# EAGLE board linuxstamp122 (EAGLE 5.03), part 1 of 2
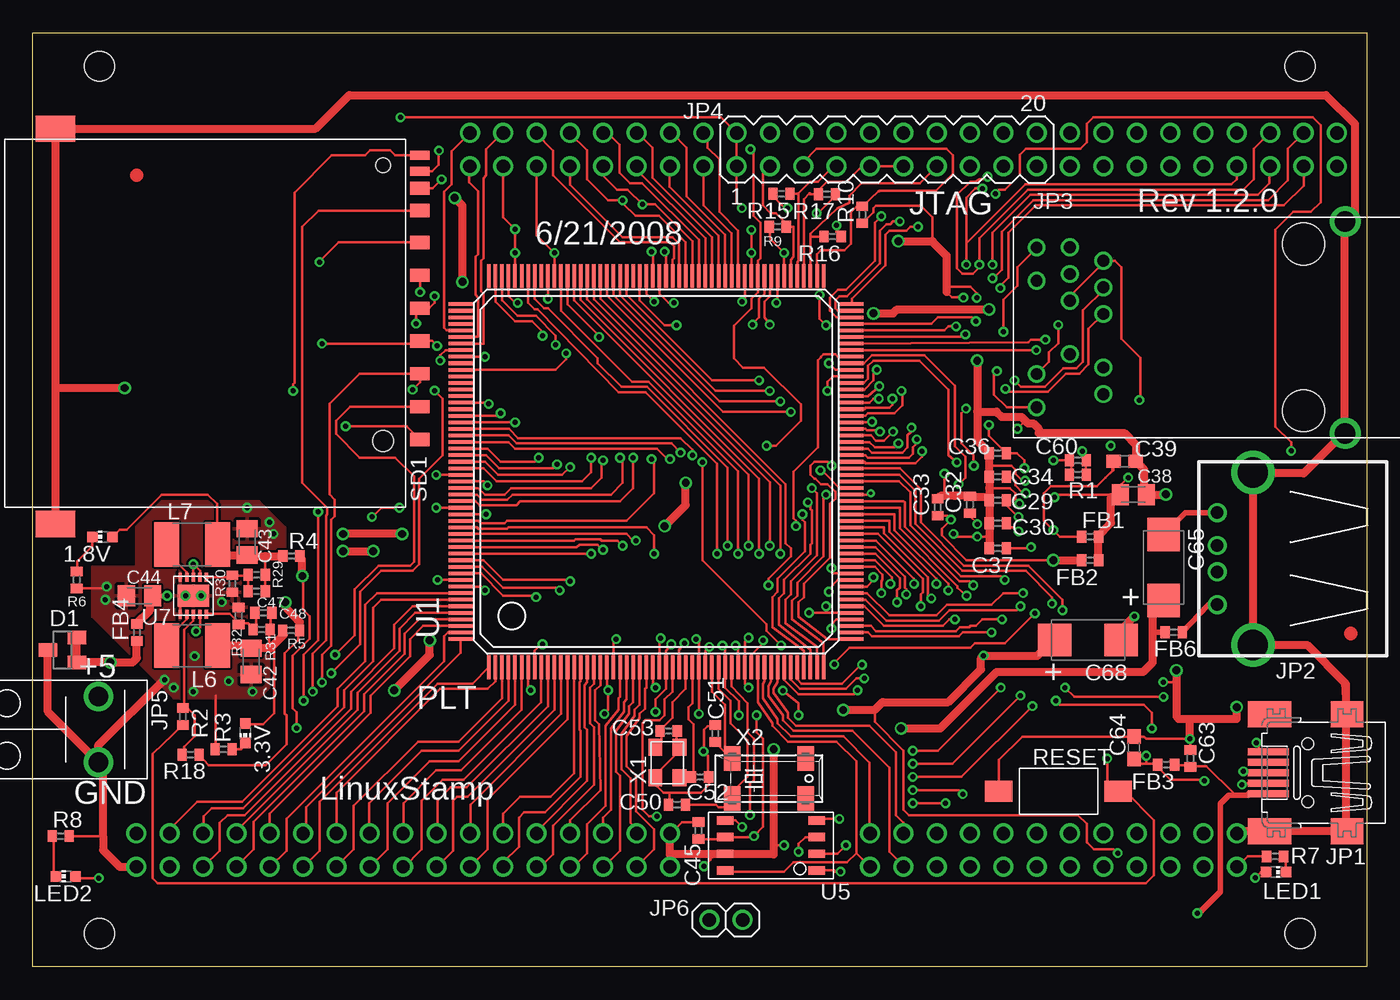
[diagram p2: board, top side]
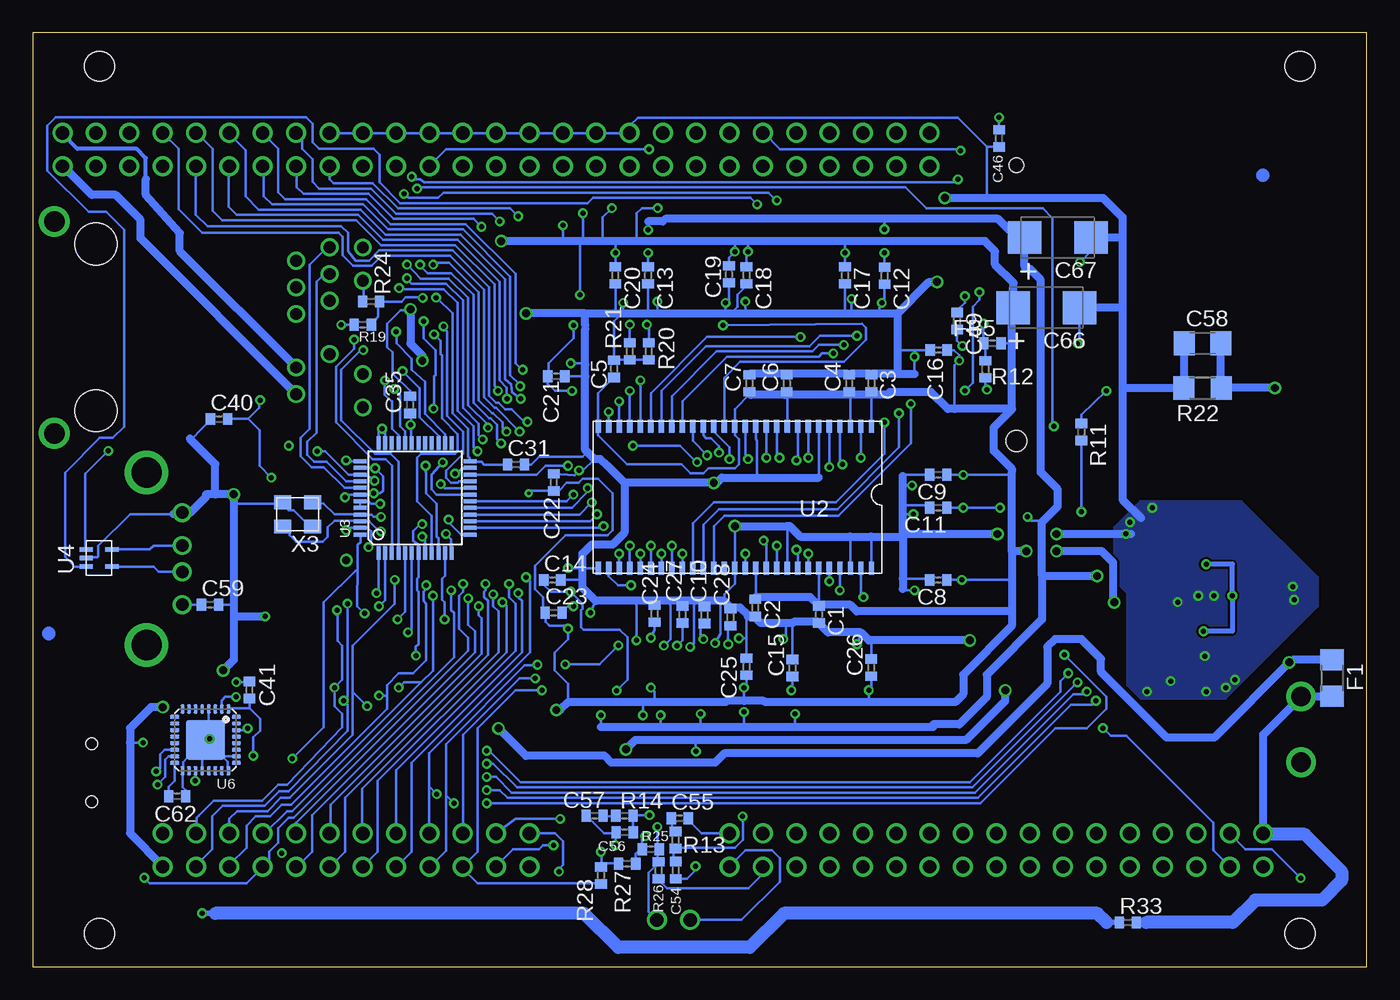
[diagram p3: board, bottom side, seen from below]

Size 101.6 x 71.12 mm. Coordinates in mm from the lower left corner, seen from the top.
Outline: 0,0 0,71.12 101.6,71.12 101.6,0 0,0
Copper layers (1*16): Top 0.035mm / dielectric 1.5mm / Bottom 0.035mm
Design rules "default *": minimum track width 0.1245mm, minimum drill 10mil, track to track 7mil, track to pad 7mil, pad to pad 7mil, via to via 7mil, smd to smd 0mil, copper to edge 8mil, drill to drill 8mil, minimum pad ring 7mil, minimum via ring 7mil, stop-mask expansion 2mil, vias tented up to drill 0mil, thermal gap 10mil
Holes 2.29 mm at 5.08,2.54 96.52,2.54 96.52,68.58 5.08,68.58

## Footprints (pad centres in the part's own frame; a part is rotated, then mirrored left to right if it is on the bottom)
CHIP-LED0603 = smd 0.8 x 0.8: A 0,-0.75; C 0,0.75
C0402 = smd 0.7 x 0.9: 1 -0.65,0; 2 0.65,0
C0805K = smd 1.3 x 1.6: 1 -1,0; 2 1,0
C0603 = smd 1.1 x 1: 1 -0.85,0; 2 0.85,0
0402 = smd 0.7 x 0.9: 1 -0.65,0; 2 0.65,0
C1206 = smd 1.6 x 1.8: 1 -1.4,0; 2 1.4,0
C/6032-28R = smd 2.55 x 2.5: + 2.525,0; - -2.525,0
SOT23 = smd 1 x 1.4: 1 -0.95,-1.1; 2 0.95,-1.1; 3 0,1.1
R1206 = smd 1.6 x 1.8: 1 -1.4,0; 2 1.4,0
1X01 = drill 1.016 round: 1 0,0
32005-201 = smd 3.1 x 0.5: 1 3,1.6; 2 3,0.8; 3 3,0; 4 3,-0.8; 5 3,-1.6 | smd 2.5 x 2: M1 -3,-4.45; M2 -3,4.45 | smd 3.3 x 2: M3 2.9,4.45; M4 2.9,-4.45 | hole 0.9: 0,2.2; 0,-2.2
PN87520 = drill 0.95 round: 1 -3.5,2.71; 2 -1,2.71; 3 1,2.71; 4 3.5,2.71 | drill 2.3 round: G1 -6.57,0; G2 6.57,0
CON-PULSE-POE-J415 = drill 0.9 round: P1 5.08,9.66; P2 3.048,9.66; P3 1.016,9.66; P5 -3.048,9.66; P6 -5.08,9.66; P7 6.096,12.2; P8 4.064,12.2; P9 2.032,12.2; P13 6.09,14.74; P14 3.55,14.74; P15 -3.55,14.74; P16 -6.09,14.74; S3 -2.032,12.2 | drill 1.57 round: S1 8.065,-8.76; S2 -8.065,-8.76 | hole 3.2: 6.35,-5.58; -6.35,-5.58
MA10-2 = drill 1.016 round: 1 -11.43,-1.27; 2 -11.43,1.27; 3 -8.89,-1.27; 4 -8.89,1.27; 5 -6.35,-1.27; 6 -6.35,1.27; 7 -3.81,-1.27; 8 -3.81,1.27; 9 -1.27,-1.27; 10 -1.27,1.27; 11 1.27,-1.27; 12 1.27,1.27; 13 3.81,-1.27; 14 3.81,1.27; 15 6.35,-1.27; 16 6.35,1.27; 17 8.89,-1.27; 18 8.89,1.27; 19 11.43,-1.27; 20 11.43,1.27
CON-PC-5.0-2 = drill 1.5 round: 1 -2.5,0; 2 2.5,0
1X02 = drill 1.016 round: 1 -1.27,0; 2 1.27,0
L1812 = smd 1.9 x 3.4: 1 -1.95,0; 2 1.95,0
R0402 = smd 0.7 x 0.9: 1 -0.65,0; 2 0.65,0
R1206' = smd 1.6 x 1.803: 1 -1.422,0; 2 1.422,0
SWITCH-6X3.5 = smd 2.1 x 1.6: 1 -4.55,0; 2 4.55,0
CON-3M-SD = smd 1 x 1.5: 1 6.35,16.35; 2 3.85,16.35; 3 1.35,16.35; 4 -1.15,16.35; 5 -3.64,16.35; 6 -6.15,16.35; 7 -8.58,16.35; 8 -10.28,16.35; 9 8.85,16.35 | smd 0.7 x 1.5: CD -11.58,16.35; WP -12.78,16.35 | smd 2 x 3: GP1 -14.81,-11.4; GP2 15.29,-11.4 | hole 1.6: 8.97,13.55 | hole 1.1: -12.03,13.55
LQFP208 = smd 1.8 x 0.27: 1 -14.9,12.75; 2 -14.9,12.25; 3 -14.9,11.75; 4 -14.9,11.25; 5 -14.9,10.75; 6 -14.9,10.25; 7 -14.9,9.75; 8 -14.9,9.25; 9 -14.9,8.75; 10 -14.9,8.25; 11 -14.9,7.75; 12 -14.9,7.25; 13 -14.9,6.75; 14 -14.9,6.25; 15 -14.9,5.75; 16 -14.9,5.25; 17 -14.9,4.75; 18 -14.9,4.25; 19 -14.9,3.75; 20 -14.9,3.25; 21 -14.9,2.75; 22 -14.9,2.25; 23 -14.9,1.75; 24 -14.9,1.25; 25 -14.9,0.75; 26 -14.9,0.25; 27 -14.9,-0.25; 28 -14.9,-0.75; 29 -14.9,-1.25; 30 -14.9,-1.75; 31 -14.9,-2.25; 32 -14.9,-2.75; 33 -14.9,-3.25; 34 -14.9,-3.75; 35 -14.9,-4.25; 36 -14.9,-4.75; 37 -14.9,-5.25; 38 -14.9,-5.75; 39 -14.9,-6.25; 40 -14.9,-6.75; 41 -14.9,-7.25; 42 -14.9,-7.75; 43 -14.9,-8.25; 44 -14.9,-8.75; 45 -14.9,-9.25; 46 -14.9,-9.75; 47 -14.9,-10.25; 48 -14.9,-10.75; 49 -14.9,-11.25; 50 -14.9,-11.75; 51 -14.9,-12.25; 52 -14.9,-12.75; 105 14.9,-12.75; 106 14.9,-12.25; 107 14.9,-11.75; 108 14.9,-11.25; 109 14.9,-10.75; 110 14.9,-10.25; 111 14.9,-9.75; 112 14.9,-9.25; 113 14.9,-8.75; 114 14.9,-8.25; 115 14.9,-7.75; 116 14.9,-7.25; 117 14.9,-6.75; 118 14.9,-6.25; 119 14.9,-5.75; 120 14.9,-5.25; 121 14.9,-4.75; 122 14.9,-4.25; 123 14.9,-3.75; 124 14.9,-3.25; 125 14.9,-2.75; 126 14.9,-2.25; 127 14.9,-1.75; 128 14.9,-1.25; 129 14.9,-0.75; 130 14.9,-0.25; 131 14.9,0.25; 132 14.9,0.75; 133 14.9,1.25; 134 14.9,1.75; 135 14.9,2.25; 136 14.9,2.75; 137 14.9,3.25; 138 14.9,3.75; 139 14.9,4.25; 140 14.9,4.75; 141 14.9,5.25; 142 14.9,5.75; 143 14.9,6.25; 144 14.9,6.75; 145 14.9,7.25; 146 14.9,7.75; 147 14.9,8.25; 148 14.9,8.75; 149 14.9,9.25; 150 14.9,9.75; 151 14.9,10.25; 152 14.9,10.75; 153 14.9,11.25; 154 14.9,11.75; 155 14.9,12.25; 156 14.9,12.75 | smd 0.27 x 1.8: 53 -12.75,-14.9; 54 -12.25,-14.9; 55 -11.75,-14.9; 56 -11.25,-14.9; 57 -10.75,-14.9; 58 -10.25,-14.9; 59 -9.75,-14.9; 60 -9.25,-14.9; 61 -8.75,-14.9; 62 -8.25,-14.9; 63 -7.75,-14.9; 64 -7.25,-14.9; 65 -6.75,-14.9; 66 -6.25,-14.9; 67 -5.75,-14.9; 68 -5.25,-14.9; 69 -4.75,-14.9; 70 -4.25,-14.9; 71 -3.75,-14.9; 72 -3.25,-14.9; 73 -2.75,-14.9; 74 -2.25,-14.9; 75 -1.75,-14.9; 76 -1.25,-14.9; 77 -0.75,-14.9; 78 -0.25,-14.9; 79 0.25,-14.9; 80 0.75,-14.9; 81 1.25,-14.9; 82 1.75,-14.9; 83 2.25,-14.9; 84 2.75,-14.9; 85 3.25,-14.9; 86 3.75,-14.9; 87 4.25,-14.9; 88 4.75,-14.9; 89 5.25,-14.9; 90 5.75,-14.9; 91 6.25,-14.9; 92 6.75,-14.9; 93 7.25,-14.9; 94 7.75,-14.9; 95 8.25,-14.9; 96 8.75,-14.9; 97 9.25,-14.9; 98 9.75,-14.9; 99 10.25,-14.9; 100 10.75,-14.9; 101 11.25,-14.9; 102 11.75,-14.9; 103 12.25,-14.9; 104 12.75,-14.9; 157 12.75,14.9; 158 12.25,14.9; 159 11.75,14.9; 160 11.25,14.9; 161 10.75,14.9; 162 10.25,14.9; 163 9.75,14.9; 164 9.25,14.9; 165 8.75,14.9; 166 8.25,14.9; 167 7.75,14.9; 168 7.25,14.9; 169 6.75,14.9; 170 6.25,14.9; 171 5.75,14.9; 172 5.25,14.9; 173 4.75,14.9; 174 4.25,14.9; 175 3.75,14.9; 176 3.25,14.9; 177 2.75,14.9; 178 2.25,14.9; 179 1.75,14.9; 180 1.25,14.9; 181 0.75,14.9; 182 0.25,14.9; 183 -0.25,14.9; 184 -0.75,14.9; 185 -1.25,14.9; 186 -1.75,14.9; 187 -2.25,14.9; 188 -2.75,14.9; 189 -3.25,14.9; 190 -3.75,14.9; 191 -4.25,14.9; 192 -4.75,14.9; 193 -5.25,14.9; 194 -5.75,14.9; 195 -6.25,14.9; 196 -6.75,14.9; 197 -7.25,14.9; 198 -7.75,14.9; 199 -8.25,14.9; 200 -8.75,14.9; 201 -9.25,14.9; 202 -9.75,14.9; 203 -10.25,14.9; 204 -10.75,14.9; 205 -11.25,14.9; 206 -11.75,14.9; 207 -12.25,14.9; 208 -12.75,14.9
TSOPII-54 = smd 0.4 x 1: 1 0,0; 2 0.8,0; 3 1.6,0; 4 2.4,0; 5 3.2,0; 6 4,0; 7 4.8,0; 8 5.6,0; 9 6.4,0; 10 7.2,0; 11 8,0; 12 8.8,0; 13 9.6,0; 14 10.4,0; 15 11.2,0; 16 12,0; 17 12.8,0; 18 13.6,0; 19 14.4,0; 20 15.2,0; 21 16,0; 22 16.8,0; 23 17.6,0; 24 18.4,0; 25 19.2,0; 26 20,0; 27 20.8,0; 28 20.8,10.8; 29 20,10.8; 30 19.2,10.8; 31 18.4,10.8; 32 17.6,10.8; 33 16.8,10.8; 34 16,10.8; 35 15.2,10.8; 36 14.4,10.8; 37 13.6,10.8; 38 12.8,10.8; 39 12,10.8; 40 11.2,10.8; 41 10.4,10.8; 42 9.6,10.8; 43 8.8,10.8; 44 8,10.8; 45 7.2,10.8; 46 6.4,10.8; 47 5.6,10.8; 48 4.8,10.8; 49 4,10.8; 50 3.2,10.8; 51 2.4,10.8; 52 1.6,10.8; 53 0.8,10.8; 54 0,10.8
TQFP48 = smd 1.016 x 0.305: 1 -4.191,2.794; 2 -4.191,2.286; 3 -4.191,1.778; 4 -4.191,1.27; 5 -4.191,0.762; 6 -4.191,0.254; 7 -4.191,-0.254; 8 -4.191,-0.762; 9 -4.191,-1.27; 10 -4.191,-1.778; 11 -4.191,-2.286; 12 -4.191,-2.794; 25 4.191,-2.794; 26 4.191,-2.286; 27 4.191,-1.778; 28 4.191,-1.27; 29 4.191,-0.762; 30 4.191,-0.254; 31 4.191,0.254; 32 4.191,0.762; 33 4.191,1.27; 34 4.191,1.778; 35 4.191,2.286; 36 4.191,2.794 | smd 0.305 x 1.016: 13 -2.794,-4.191; 14 -2.286,-4.191; 15 -1.778,-4.191; 16 -1.27,-4.191; 17 -0.762,-4.191; 18 -0.254,-4.191; 19 0.254,-4.191; 20 0.762,-4.191; 21 1.27,-4.191; 22 1.778,-4.191; 23 2.286,-4.191; 24 2.794,-4.191; 37 2.794,4.191; 38 2.286,4.191; 39 1.778,4.191; 40 1.27,4.191; 41 0.762,4.191; 42 0.254,4.191; 43 -0.254,4.191; 44 -0.762,4.191; 45 -1.27,4.191; 46 -1.778,4.191; 47 -2.286,4.191; 48 -2.794,4.191
SOT323-5 = smd 0.35 x 1: 1 0.65,0.975; 2 0,0.975; 3 -0.65,0.975; 4 -0.65,-0.975; 5 0.65,-0.975
CASON-8 = smd 1.27 x 0.635: 1 -3.5,1.905; 2 -3.5,0.635; 3 -3.5,-0.635; 4 -3.5,-1.905; 5 3.485,-1.905; 6 3.485,-0.635; 7 3.485,0.635; 8 3.485,1.905
MLF32_2 = smd 0.7 x 0.3: 1 -2.35,1.75; 2 -2.35,1.25; 3 -2.35,0.75; 4 -2.35,0.25; 5 -2.35,-0.25; 6 -2.35,-0.75; 7 -2.35,-1.25; 8 -2.35,-1.75; 17 2.35,-1.75; 18 2.35,-1.25; 19 2.35,-0.75; 20 2.35,-0.25; 21 2.35,0.25; 22 2.35,0.75; 23 2.35,1.25; 24 2.35,1.75 | smd 0.3 x 0.7: 9 -1.75,-2.35; 10 -1.25,-2.35; 11 -0.75,-2.35; 12 -0.25,-2.35; 13 0.25,-2.35; 14 0.75,-2.35; 15 1.25,-2.35; 16 1.75,-2.35; 25 1.75,2.35; 26 1.25,2.35; 27 0.75,2.35; 28 0.25,2.35; 29 -0.25,2.35; 30 -0.75,2.35; 31 -1.25,2.35; 32 -1.75,2.35 | smd 3 x 3: 33 0,0
DFN-10 = smd 0.25 x 0.675: 1 -1,-1.413; 2 -0.5,-1.413; 3 0,-1.413; 4 0.5,-1.413; 5 1,-1.413; 6 1,1.413; 7 0.5,1.413; 8 0,1.413; 9 -0.5,1.413; 10 -1,1.413 | smd 2.38 x 1.65: 11 0,0
CRYSTAL-3.2-2.5 = smd 1.3 x 1.05: 1 -1.15,-0.925; 2 1.15,-0.925; 3 1.15,0.925; 4 -1.15,0.925
MM20SS = smd 1.27 x 1.88: 1 -2.794,-1.524; 2 2.794,-1.524; 3 2.794,1.524; 4 -2.794,1.524

## Placement (x,y rotation side)
1.8V  [CHIP-LED0603]  5.3,32.74 90 top
3.3V  [CHIP-LED0603]  16.19,17.78 180 top
C1  100n  [C0402]  41.72,26.83 270 bottom
C2  100n  [C0402]  46.57,27.33 270 bottom
C3  100n  [C0402]  37.72,44.43 90 bottom
C4  100n  [C0402]  39.42,44.43 90 bottom
C5  100n  [C0402]  57.32,45.53 90 bottom
C6  100n  [C0402]  44.17,44.43 90 bottom
C7  100n  [C0402]  47.02,44.43 90 bottom
C8  100n  [C0402]  32.63,29.46 180 bottom
C9  100n  [C0402]  32.63,37.46 180 bottom
C10  100n  [C0402]  50.44,26.79 90 bottom
C11  100n  [C0402]  32.63,34.96 180 bottom
C12  100n  [C0402]  36.72,52.63 270 bottom
C13  100n  [C0402]  54.73,52.66 270 bottom
C14  100n  [C0402]  62.03,29.46 0 bottom
C15  100n  [C0402]  43.73,22.76 90 bottom
C16  100n  [C0402]  32.6,46.97 180 bottom
C17  100n  [C0402]  39.73,52.66 270 bottom
C18  100n  [C0402]  47.23,52.66 270 bottom
C19  100n  [C0402]  48.57,52.73 270 bottom
C20  100n  [C0402]  57.23,52.66 270 bottom
C21  100n  [C0402]  61.73,44.96 0 bottom
C22  100n  [C0402]  61.92,36.89 90 bottom
C23  100n  [C0402]  61.93,26.96 0 bottom
C24  100n  [C0402]  54.24,26.89 90 bottom
C25  100n  [C0402]  47.23,22.86 90 bottom
C26  100n  [C0402]  37.74,22.79 90 bottom
C27  100n  [C0402]  52.12,26.83 90 bottom
C28  100n  [C0402]  48.47,26.63 90 bottom
C29  18pF  [C0402]  73.5,35.53 180 top
C30  18pF  [C0402]  73.5,33.78 180 top
C31  100n  [C0402]  64.8,38.25 0 bottom
C32  100n  [C0402]  71.37,35.19 90 top
C33  100n  [C0402]  68.92,34.99 90 top
C34  100n  [C0402]  73.5,37.32 180 top
C35  100n  [C0402]  72.87,42.79 90 bottom
C36  100n  [C0402]  73.5,39.12 180 top
C37  100n  [C0402]  73.5,31.87 180 top
C38  10uF  [C0805K]  83.83,35.96 0 top
C39  4.7uF  [C0603]  83.16,38.5 0 top
C40  100n  [C0402]  87.42,41.71 0 bottom
C41  100n  [0402]  85.1,21.08 90 bottom
C42  10uF  [C0805K]  16.63,23.26 270 top
C43  10uF  [C0805K]  16.33,32.36 270 top
C44  10uF  [C0805K]  8.13,28.26 0 top
C45  100n  [C0402]  50.7,10.38 90 top
C46  100n  [C0402]  28,63.08 90 bottom
C47  22pF  [0402]  17.06,28.6 180 top
C48  22pF  [0402]  17.56,26.96 180 top
C49  100nF  [C0402]  31.2,49.18 270 bottom
C50  12.5p  [C0402]  49.07,12.35 180 top
C51  12.5p  [C0402]  51.98,17.77 90 top
C52  18p  [C0402]  50.83,14.46 0 top
C53  18p  [C0402]  48.43,17.96 0 top
C54  680p  [C0402]  52.63,7.37 270 bottom
C55  5.6n  [C0402]  52.32,11.31 0 bottom
C56  470p  [C0402]  56.52,10.26 180 bottom
C57  4.7n  [C0402]  58.82,11.51 180 bottom
C58  1000pF  [C1206]  12.5,47.48 0 bottom
C59  100n  [C0402]  88.1,27.58 0 bottom
C60  100pF  [C0402]  79.6,37.48 0 top
C62  100n  [0402]  90.61,13 0 bottom
C63  10n  [0402]  88.17,15.87 90 top
C64  4.7uF  [C0603]  83.88,16.69 90 top
C65  100uF  [C/6032-28R]  86.13,30.41 270 top
C66  100uF  [C/6032-28R]  24.4,50.18 180 bottom
C67  100uF  [C/6032-28R]  23.53,55.53 180 bottom
C68  100uF  [C/6032-28R]  80.37,24.89 180 top
D1  [SOT23]  2.25,24.13 90 top
F1  [R1206]  2.63,22 90 bottom
FB1  [0402]  80.53,32.76 0 top
FB2  [0402]  80.53,30.96 180 top
FB3  [0402]  86.32,15.4 180 top
FB4  L0402  [0402]  7.93,25.46 90 top
FB5  [0402]  28.5,47.48 0 bottom
FB6  [0402]  86.9,25.48 0 top
J2  [1X01]  63.77,7.62 0 top
J3  [1X01]  63.77,10.16 0 top
J4  [1X01]  66.31,7.62 0 top
J5  [1X01]  66.31,10.16 0 top
J6  [1X01]  68.85,7.62 0 top
J7  [1X01]  68.85,10.16 0 top
J8  [1X01]  71.39,7.62 0 top
J9  [1X01]  71.39,10.16 0 top
J10  [1X01]  73.93,7.62 0 top
J11  [1X01]  73.93,10.16 0 top
J12  [1X01]  76.47,7.62 0 top
J13  [1X01]  76.47,10.16 0 top
J14  [1X01]  79.01,7.62 0 top
J15  [1X01]  79.01,10.16 0 top
J16  [1X01]  81.55,7.62 0 top
J17  [1X01]  81.55,10.16 0 top
J18  [1X01]  84.09,7.62 0 top
J19  [1X01]  84.09,10.16 0 top
J20  [1X01]  86.63,7.62 0 top
J21  [1X01]  86.63,10.16 0 top
J22  [1X01]  89.17,7.62 0 top
J23  [1X01]  89.17,10.16 0 top
J24  [1X01]  38.37,7.62 0 top
J25  [1X01]  40.91,10.16 0 top
J26  [1X01]  40.91,7.62 0 top
J27  [1X01]  43.45,10.16 0 top
J28  [1X01]  43.45,7.62 0 top
J29  [1X01]  45.99,10.16 0 top
J30  [1X01]  45.99,7.62 0 top
J31  [1X01]  33.29,63.5 0 top
J32  [1X01]  33.29,60.96 0 top
J33  [1X01]  35.83,63.5 0 top
J34  [1X01]  30.75,7.62 0 top
J35  [1X01]  33.29,10.16 0 top
J36  [1X01]  33.29,7.62 0 top
J37  [1X01]  35.83,10.16 0 top
J38  [1X01]  35.83,7.62 0 top
J39  [1X01]  38.37,10.16 0 top
J40  [1X01]  10.43,10.16 0 top
J41  [1X01]  12.97,10.16 0 top
J42  [1X01]  12.97,7.62 0 top
J43  [1X01]  15.51,10.16 0 top
J44  [1X01]  15.51,7.62 0 top
J45  [1X01]  18.05,10.16 0 top
J46  [1X01]  18.05,7.62 0 top
J47  [1X01]  20.59,10.16 0 top
J48  [1X01]  20.59,7.62 0 top
J49  [1X01]  23.13,10.16 0 top
J50  [1X01]  23.13,7.62 0 top
J51  [1X01]  25.67,10.16 0 top
J52  [1X01]  25.67,7.62 0 top
J53  [1X01]  28.21,10.16 0 top
J54  [1X01]  28.21,7.62 0 top
J55  [1X01]  30.75,10.16 0 top
J56  [1X01]  96.79,60.96 0 top
J57  [1X01]  96.79,63.5 0 top
J58  [1X01]  94.25,60.96 0 top
J59  [1X01]  94.25,63.5 0 top
J60  [1X01]  91.71,60.96 0 top
J61  [1X01]  91.71,63.5 0 top
J62  [1X01]  89.17,60.96 0 top
J63  [1X01]  89.17,63.5 0 top
J64  [1X01]  86.63,60.96 0 top
J65  [1X01]  86.63,63.5 0 top
J66  [1X01]  84.09,60.96 0 top
J67  [1X01]  84.09,63.5 0 top
J68  [1X01]  79.01,60.96 0 top
J69  [1X01]  81.55,63.5 0 top
J70  [1X01]  81.55,60.96 0 top
J71  [1X01]  51.07,63.5 0 top
J72  [1X01]  51.07,60.96 0 top
J73  [1X01]  48.53,63.5 0 top
J74  [1X01]  48.53,60.96 0 top
J75  [1X01]  45.99,63.5 0 top
J76  [1X01]  45.99,60.96 0 top
J77  [1X01]  43.45,63.5 0 top
J78  [1X01]  38.37,63.5 0 top
J79  [1X01]  40.91,60.96 0 top
J80  [1X01]  7.89,10.16 0 top
J81  [1X01]  7.89,7.62 0 top
J82  j85  [1X01]  43.45,60.96 0 top
J83  j85  [1X01]  40.91,63.5 0 top
J84  j85  [1X01]  38.37,60.96 0 top
J85  j85  [1X01]  35.83,60.96 0 top
J86  [1X01]  79.01,63.5 0 top
J87  j85  [1X01]  48.53,10.16 0 top
J88  j85  [1X01]  48.53,7.62 0 top
J89  j85  [1X01]  91.71,10.16 0 top
J90  j85  [1X01]  91.71,7.62 0 top
J91  j85  [1X01]  99.33,60.96 0 top
J92  j85  [1X01]  99.33,63.5 0 top
J93  j85  [1X01]  10.43,7.62 0 top
JP1  [32005-201]  97.1,14.78 180 top
JP2  [PN87520]  92.93,31.08 90 top
JP3  CON-PULSE-POE-J14  [CON-PULSE-POE-J415]  91.2,48.69 90 top
JP4  JTAG  [MA10-2]  65.04,62.23 0 top
JP5  [CON-PC-5.0-2]  5,18.08 270 top
JP6  [1X02]  52.8,3.57 180 top
L6  2.2uH  [L1812]  12.13,24.46 180 top
L7  2.2uH  [L1812]  12.13,32.16 0 top
LED1  [CHIP-LED0603]  94.7,7.22 270 top
LED2  [CHIP-LED0603]  2.5,6.89 90 top
R1  6.49k  [R0402]  79.6,38.57 180 top
R2  10k  [0402]  11.43,19.06 270 top
R3  200  [0402]  14.53,16.56 0 top
R4  0  [0402]  19.7,31.28 180 top
R5  0  [0402]  19.68,25.62 0 top
R6  200  [0402]  3.34,29.46 270 top
R7  200  [0402]  94.62,8.41 0 top
R8  200  [0402]  2.13,9.96 0 top
R9  100k  [R0402]  56.74,56.36 0 top
R10  100k  [R0402]  63.18,57.27 90 top
R11  0  [R0402]  21.74,40.73 270 bottom
R12  10k  [R0402]  29.03,45.5 90 bottom
R13  1.27k  [R0402]  52.64,9.66 270 bottom
R14  1.96k  [R0402]  56.54,11.51 0 bottom
R15  100k  [R0402]  57.02,58.86 180 top
R16  100k  [R0402]  60.92,55.61 180 top
R17  100k  [R0402]  60.49,58.83 180 top
R18  100k  [0402]  12.03,16.16 0 top
R19  200  [R0402]  76.47,48.9 180 bottom
R20  1k  [R0402]  54.68,46.87 90 bottom
R21  1k  [R0402]  56.13,46.87 90 bottom
R22  1M  [R1206']  12.5,44.08 180 bottom
R24  200  [R0402]  75.83,50.66 180 bottom
R25  [R0402]  54.53,8.96 0 bottom
R26  [R0402]  53.93,7.36 270 bottom
R27  [R0402]  56.33,7.86 180 bottom
R28  [R0402]  58.33,6.96 270 bottom
R29  887k  [0402]  17.06,29.84 180 top
R30  442k  [0402]  15.2,29.18 270 top
R31  887k  [0402]  17.44,25.69 0 top
R32  197k  [0402]  15.69,26.72 90 top
R33  0  [0402]  18.2,3.38 0 bottom
RESET  SWITCH-PUSHBUTTON-6X3.5  [SWITCH-6X3.5]  78.13,13.36 0 top
SD1  CON-EM-SD  [CON-3M-SD]  13.13,49.01 270 top
U1  AT91RM9200_PQFP  [LQFP208]  47.48,37.71 90 top
U2  MT48LC8M16A2  [TSOPII-54]  37.73,41.16 180 bottom
U3  MICREL-KS8721  [TQFP48]  72.48,35.71 90 bottom
U4  USBDF01W5  [SOT323-5]  96.55,31.13 90 bottom
U5  DATAFLASH-8  [CASON-8]  56.22,9.25 180 top
U6  FT232RQ2  [MLF32_2]  88.45,17.28 270 bottom
U7  PS-LTC3407-3  [DFN-10]  12.23,28.26 180 top
U$1  [FIDUCIAL_G10]  7.9,60.28 0 top
U$2  [FIDUCIAL_G10]  100.4,25.38 0 top
U$3  [FIDUCIAL_G10]  7.9,60.28 0 bottom
U$4  [FIDUCIAL_G10]  100.4,25.38 0 bottom
X1  18.432  [CRYSTAL-3.2-2.5]  48.33,15.56 90 top
X2  32.768khz  [MM20SS]  56.07,14.34 0 top
X3  25.0  [CRYSTAL-3.2-2.5]  81.43,34.46 180 bottom

## Tracks (layer width: path | path; a pad name or v marks a point on that pad's centre or on a via)
1V8
  Top 0.178: 14.71,31.53 14.83,31.66 14.83,31.27 | 14.13,32.16 14.23,32.06 | 14.13,32.16 L7.2 | 14.13,32.16 14.03,32.26 14.03,35.26 13.33,35.96 9.83,35.96 7.15,33.28 6.6,33.28 1.8V.A | R29.1 C47.1 | R29.1 17.71,29.87 17.7,29.88 | R29.1 17.71,31.27 17.7,31.28
  Top 0.6: L7.2 14.71,31.53 14.88,31.36 C43.2 16.43,31.26 16.45,31.28 17.7,31.28 19.14,31.28 R4.2
3V3
  Top 0.178: 14.08,24.41 14.13,24.36 | L6.1 14.08,24.41 | 14.08,24.41 13.23,25.26 | 3.3V.A 16.2,18.48 17.55,18.48 18.4,19.33 18.4,24.48 18.35,24.53 | 18.15,24.33 18,24.48 18,25.68 R31.2 18.1,25.8 18.1,26.97 | 18.1,26.97 18.1,26.98 | 18.1,26.97 C48.1
  Top 0.6: L6.1 16.33,24.46 16.63,24.16 C42.1 18.08,24.26 18.15,24.33 18.35,24.53 19.13,25.31 R5.1
5V  (via drill 0.38 pad 0.74)
  Top 0.178: U7.3 12.23,29.76 | U7.9 12.73,25.86 v12.43,25.56 | U7.3 | U7.3 v12.23,30.66 12.73,30.16 U7.2
  Top 0.381: C44.2 v10.23,28.26
  Top 0.6: FB4.2 7.93,26.16 8.93,27.16 8.93,28.06 C44.2
  Bottom 0.381: v12.23,30.66 10.23,30.66 v10.23,28.26 10.23,25.56 v12.43,25.56
+1V8  (via drill 0.38 pad 0.74, 0.6 pad 0.9)
  Top 0.178: 36.73,52.56 36.74,52.57 | v43.83,21.06 43.73,21.16 U1.19 43.73,21.06 v43.83,21.06 | 36.73,52.56 U1.152 | 54.73,52.56 U1.116 v54.73,54.36 v54.73,56.11 | 36.73,52.56 v36.73,54.36 v36.73,56.16 35.83,57.06 J85.1 | v43.53,19.26 43.83,19.56 v43.83,21.06 | v50.73,19.26 50.73,22.76 | v52.53,24.46 52.73,24.26 U1.37 52.73,21.26 53.78,20.21 v53.78,19.16 | 50.73,22.76 U1.33 | 50.73,22.76 50.73,24.76 v50.53,24.96 | 48.23,22.96 48.23,24.06 v48.63,24.56 | 30.83,34.96 v30.73,34.96 U1.188 | U1.62 61.33,29.46 60.63,28.76 v60.63,28.56 | v58.33,19.16 58.33,20.06 v57.13,21.04 | v47.43,19.41 47.43,20.36 48.23,21.16 48.23,22.96 | 48.23,22.96 U1.28 | v25.83,34.26 25.88,34.26 26.58,34.96 v27.93,34.96 | v20.1,18.18 20.1,19.38 19.8,19.68 19.8,23.68 21.1,24.98 21.1,26.68 20.6,27.18 20.6,29.78
  Top 0.6: 20.6,29.78 20.58,29.76 v20.53,29.76 20.51,29.78 20.5,29.78 20.5,31.03 R4.1
  Bottom 0.178: C10.1 50.73,25.85 50.73,25.16 v50.53,24.96 | 54.73,56.76 v54.73,56.11 | 36.73,56.96 v36.73,56.16 | C12.1 36.72,54.45 v36.73,54.36 | v54.73,54.36 C13.1 | v43.83,21.06 43.73,21.06 C15.1 | 43.73,18.16 43.53,18.26 v43.53,19.26 | C27.1 52.12,24.87 v52.53,24.46 | 50.73,18.26 v50.73,19.26 | 47.43,18.26 v47.43,19.41 | C11.1 v30.73,34.96 v27.93,34.96 | 53.63,18.06 53.78,18.26 v53.78,19.16 | C14.1 62.68,29.11 62.13,28.56 v60.63,28.56 59.73,27.66 59.73,27.26 59.83,27.16 59.83,25.86 59.65,25.68 56.9,25.68 56.3,25.08 56.3,21.87 v57.13,21.04 | 58.33,18.26 v58.33,19.16 | C28.1 48.63,25.82 v48.63,24.56 | 24.58,34.01 24.53,33.96 25.58,33.96 25.88,34.26 | J93.1 11.7,8.89 11.7,10.98 18.3,17.58 19.5,17.58 v20.1,18.18 | 25.88,34.26 25.9,34.28 | 25.88,34.26 v25.83,34.26
  Bottom 0.6: 58.33,18.26 53.78,18.26 50.73,18.26 47.43,18.26 43.53,18.26 33.03,18.26 33.03,18.46 31.03,18.46 28.93,20.56 28.93,22.26 24.73,26.46 24.73,29.78 | 24.73,29.78 24.73,33.86 24.58,34.01 23.53,35.06 23.53,36.36 24.83,37.66 24.83,52.31 25.7,53.18 26,53.18 26,53.28 26.05,53.34 C67.+ 26.05,55.23 26.2,55.08 28.08,56.96 36.73,56.96 53.42,56.96 53.62,56.76 54.73,56.76 | 24.73,29.78 24.7,29.78 24.68,29.76 v20.53,29.76
+2V5A  (via drill 0.38 pad 0.74, 0.6)
  Top 0.178: v77.73,30.96 71.13,30.96 69.23,32.86 69.23,33.36 v69.93,34.06 69.65,34.34 C33.1
  Top 0.6: v77.73,30.96 FB2.2
  Bottom 0.178: U3.13 68.99,32.92 69.93,33.86 v69.93,34.06
+2V5B  (via drill 0.38 pad 0.74)
  Top 0.178: v75.53,37.96 75.53,38.56 74.97,39.12 C36.1 72.83,40.44 v72.83,41.26 | C34.1 74.47,37.32 74.83,36.96 74.83,36.66 75.43,36.06 v75.63,36.06 | v77.83,35.76 78.03,35.96 82.53,35.96 | 82.03,35.76 82.13,35.76 82.43,35.76 82.63,35.96 | C38.1 82.93,36.06 82.93,36.76 v83.43,37.26 | JP3.P9 79,51.08 81.54,53.62 JP3.P1 82.41,53.77 82.9,53.28 82.9,47.83 84.35,46.38 84.35,43.13 arc-90 84.3,43.08 arc-90 84.28,43.1 v84.28,43.16
  Top 0.6: 82.53,35.96 82.63,35.96 C38.1 83,35.96 | FB2.1 81.13,31.01 81.13,32.76 FB1.2 82.13,33.81 82.13,35.76
  Bottom 0.178: 72.82,40.95 v72.83,41.26 72.81,41.28 72.8,41.28 | 72.73,39.86 | 72.73,39.86 U3.31 | v75.63,36.06 75.73,35.96 U3.42 77.63,35.96 v77.83,35.76 | 76.71,37.96 U3.38 75.87,38 v75.53,37.96 74.93,37.36 74.93,36.26 75.13,36.06 v75.63,36.06 | v75.63,36.06 75.73,36.16 75.63,36.16 | v83.43,37.26 84.33,38.16 84.33,40.86 85.2,41.73 | 72.73,39.86 72.8,39.93 72.8,41.28 | C35.1 72.8,42.17 72.8,41.28 | 86.89,41.73 86.9,41.73 | 86.89,41.73 C40.2 | 85.2,41.73 86.89,41.73 | 85.2,41.73 84.35,42.58 84.35,43.13 arc90 84.3,43.18 arc90 v84.28,43.16
+2V5C  (via drill 0.38 pad 0.74)
  Top 0.178: C37.1 75.82,31.87 v76.03,31.96 | FB1.1 78.23,32.76 v77.73,33.26 77.03,33.96 77.03,36.06 77.55,36.58 81.05,36.58 81.71,37.24 | 81.71,37.24 82.23,37.76 82.23,38.36 82.27,38.4 C39.1 | 81.71,37.24 82.3,37.83 82.3,38.58
  Top 0.6: C39.1 82.31,38.38 82.33,38.36 82.23,38.26
  Bottom 0.178: v77.73,33.26 77.57,33.42 U3.47 76.09,33.42 75.83,33.16 75.83,31.86 v76.03,31.96
+3V3  (via drill 0.25 pad 0.51, 0.38 pad 0.74, 0.6, 0.6 pad 0.9)
  Top 0.178: v54.53,21.26 54.23,21.56 54.23,22.86 | v31.03,46.16 31.03,46.56 31.43,46.96 U1.164 32.63,46.96 | v60.83,25.76 60.83,26.06 61.23,26.46 U1.56 | v59.93,51.16 59.93,49.36 v60.43,48.86 | v72.42,23.71 v72.43,23.71 | v55.13,19.16 55.13,17.86 55.63,17.36 55.63,10.66 v54.93,9.96 54.83,9.86 52.73,9.86 U5.6 | 64.13,19.56 64.13,18.66 66.33,16.46 66.33,11.96 66.73,11.56 79.62,11.56 80.3,10.88 80.3,9.48 80.32,9.46 80.33,9.46 80.83,8.96 82.32,8.96 v82.62,8.66 v82.63,8.66 | v71.93,33.71 71.93,33.76 71.37,34.32 C32.1 | 54.23,22.86 54.23,24.76 v54.53,25.06 | 47.23,52.56 U1.131 47.23,54.36 v47.13,54.46 | 57.23,52.56 U1.111 v57.23,54.36 56.19,55.4 R9.1 | 62.23,35.96 U1.75 63.73,35.96 v63.83,36.06 | v60.53,43.86 60.53,44.56 60.93,44.96 C21.1 | 54.23,22.86 U1.40 | v47.43,21.26 47.23,21.46 47.23,21.86 | 47.23,21.86 47.23,21.96 | U1.7 37.73,21.26 v37.93,21.06 | 47.23,21.86 U1.26 | 30.63,37.46 v30.73,37.46 U1.183 | v30.83,29.46 U1.199 | U1.146 v39.73,54.36 v39.72,54.36 38.37,55.71 J84.1 | U1.129 48.23,54.36 v48.13,54.46 | R10.1 63.29,56.72 64.03,57.46 64.03,57.76 64.23,57.96 67.63,57.96 68.53,57.06 68.53,55.26 68.53,55.16 | R16.1 61.23,55.85 v61.23,56.46 | R18.2 13.38,15.36 17.73,15.36 19.33,16.96 19.33,19.15 19.2,19.28 19.2,23.88 20.2,24.88 20.2,25.29 R5.2 | R17.1 61,58.79 61,58.58 59.8,57.38 v59.7,57.38 | U5.6 52.8,9.88 52.75,9.83 | 68.5,55.26 68.5,55.28 | v70.88,50.96 70.9,50.98 70,50.98 69.6,51.38 | v71.9,50.93 71.9,51.28 71.4,51.78 69.6,51.78 | v28,64.68 52.4,64.68 53.6,63.48 JP4.2 53.61,63.57 | 53.61,63.57 JP4.1 53.61,58.17 v54,57.78 | 53.61,63.57 53.6,63.58 | v57.5,57.78 57.3,57.78 56.47,58.61 R15.2
  Top 0.178: U5.6 52.7,9.88 52.55,9.73 C45.1
  Top 0.406: 72.45,23.68 v72.42,23.71 72.4,23.68
  Top 0.6: v61.73,19.56 64.13,19.56 64.73,20.16 69.73,20.16 72.23,22.66 72.23,23.51 v72.42,23.7 v72.42,23.71 | v65.93,55.26 68.5,55.26 | 68.5,55.26 68.53,55.26 | v23.63,31.66 v25.93,31.66 | 19.2,27.68 19.23,27.71 v19.23,27.76 19.21,27.78 19.2,27.78 19.2,27.48 20.33,26.25 R5.2 | 68.5,55.26 69.6,54.16 69.6,51.78 69.6,51.38 | C68.+ 77.71,24.89 76.5,23.68 72.45,23.68
  Bottom 0.178: 46.53,28.16 U2.43 | 41.73,30.46 U2.49 41.73,27.99 C1.1 | 37.73,41.06 U2.1 | 37.73,41.06 37.63,40.96 | C5.1 58.53,43.67 U2.27 58.53,40.46 56.33,38.26 52.18,38.26 51.5,37.58 50.5,37.58 50.12,37.96 48.13,37.96 47.83,38.26 47.83,40.16 48.13,40.46 U2.14 48.13,42.46 46.93,43.66 47.02,43.75 C7.1 | 36.53,43.56 37.53,43.56 37.73,43.76 C3.1 37.72,43.67 37.73,43.66 | 39.33,43.66 U2.3 | 37.73,43.66 37.73,41.06 | C4.1 39.43,43.76 39.33,43.66 | 37.73,43.66 39.33,43.66 | U2.9 44.13,43.66 44.17,43.7 C6.1 44.21,43.78 44.33,43.66 44.33,43.56 | 48.13,55.26 v48.13,54.46 | 47.13,55.26 v47.13,54.46 47.23,54.36 C18.1 | 37.93,20.16 v37.93,21.06 37.73,21.26 37.73,21.86 | 47.43,20.26 v47.43,21.26 47.23,21.46 C25.1 | 54.23,20.06 54.23,20.16 54.23,20.96 v54.53,21.26 | C26.1 37.73,22.16 37.73,21.86 | 27.03,29.46 v30.83,29.46 C8.1 | 27.03,37.46 v30.73,37.46 C9.1 | 27.03,42.46 26.93,43.76 | 72.23,31.46 U3.7 | 62.53,26.26 62.33,26.06 | 62.53,26.26 62.53,26.96 | 60.83,20.16 60.83,21.56 61.85,22.58 61.85,23.93 60.83,24.95 v60.83,25.76 61.03,25.96 62.23,25.96 62.53,26.26 | 57.23,55.26 v57.23,54.36 C20.1 | v60.43,48.86 60.43,47.86 62.33,45.96 62.33,44.96 | v72.42,23.71 72.43,24.36 72.23,24.56 72.23,28.56 72.33,28.66 72.33,29.56 72.23,29.66 U3.7 | 59.93,55.26 v59.93,51.16 | 55.03,20.26 55.13,20.16 v55.13,19.16 | v65.93,55.26 65.93,55.36 | C31.1 67.22,38.25 67.43,38.46 68.23,38.46 68.27,38.5 U3.24 68.33,38.46 68.33,38.76 68.43,38.86 68.43,40.96 69.63,42.16 69.63,49.76 70.75,50.88 70.8,50.88 v70.88,50.96 | U3.7 72.23,31.96 72.23,32.06 72.23,32.16 72.63,32.46 72.63,33.16 72.13,33.66 v71.93,33.71 | C24.1 54.23,25.66 v54.53,25.06
  Bottom 0.178: 62.53,26.96 62.63,26.96 62.73,27.06 62.73,28.16 63.33,28.76 63.33,30.56 61.03,32.86 57.83,32.86 57.43,33.26 57.43,36.06 58.53,37.16 59.73,37.16 60.03,36.86 60.93,36.86 61.45,36.34 C22.1 63.64,36.24 v63.82,36.06 v63.83,36.06 | v60.53,43.86 61.83,43.86 62.38,44.41 62.38,44.91 62.33,44.96 | 62.53,26.96 C23.1 | 37.73,21.86 37.74,21.87 C26.1 | C16.1 32.12,46.97 32.13,46.96 31.43,46.96 31.03,46.56 v31.03,46.16 31.4,45.79 31.4,42.48 31.4,42.38 | C17.1 v39.73,54.36 39.73,55.25 39.7,55.28 39.7,55.26 | v48.13,54.46 48.37,54.22 | 62.33,44.96 C21.1 | v61.23,56.46 61.23,55.06 61.03,55.26 59.83,55.26 | 59.7,55.18 59.7,55.26 v59.7,57.38 | v28,64.68 C46.2 | v71.9,50.93 72.2,50.93 72.25,50.98 73.2,50.98 73.52,50.66 R24.1 75.3,50.68 75.3,49.52 R19.1 | v54,57.78 55.2,57.78 55.6,57.38 55.6,55.26 55.6,55.18 | 58.2,55.18 58.2,55.26 58.2,57.08 v57.5,57.78 | 27.03,47.48 FB5.2 | R27.1 55.68,8.6 55.2,9.08 55.18,9.06 R25.1 55.18,9.7 v54.93,9.95 v54.93,9.96 | C19.1 48.57,54.01 v48.13,54.45 v48.13,54.46
  Bottom 0.18: R25.1 55.1,8.98 55.2,8.88 | v54.92,9.96 54.9,9.98 | v54.93,9.96 v54.92,9.96 | v54.92,9.96 55.08,9.8
  Bottom 0.6: C2.1 46.53,28.02 46.53,28.16 42.4,28.16 C1.1 41.64,27.56 39.33,27.56 38.83,27.06 27.03,27.06 | C7.1 47.02,43.65 46.93,43.56 44.33,43.56 36.53,43.56 36.33,43.76 33.18,43.76 31.9,42.48 31.4,42.48 27,42.48 27.02,42.46 27.03,42.46 | 27.03,27.06 27.03,29.46 27.03,31.66 | 27.03,31.66 27.03,37.46 27,37.88 28.4,39.28 28.4,41.08 27.03,42.45 27.03,42.46 | 27.03,27.06 27.03,25.96 30.73,22.26 30.73,20.76 31.33,20.16 37.93,20.16 45.83,20.16 45.93,20.26 47.43,20.26 48.73,20.26 48.83,20.16 54.23,20.16 55.13,20.16 60.83,20.16 61.43,19.56 v61.73,19.56 | v65.93,55.26 59.93,55.26 59.83,55.26 59.7,55.26 58.2,55.26 57.23,55.26 55.6,55.26 48.13,55.26 47.13,55.26 39.7,55.26 29.08,55.26 28.3,54.48 28.3,53.48 26.9,52.08 26.9,49.91 27.03,49.78 | v25.93,31.66 27.03,31.66 | v23.63,31.66 20.18,31.66 19.3,30.78 19.3,27.88 19.2,27.78 v19.22,27.76 v19.23,27.76 | 26.93,50.25 26.9,50.28 | 26.93,50.25 C66.+ 27,50.18 27.1,50.28 27.2,50.18 27.7,50.18 | 27.03,42.46 27.03,47.48 27.03,49.78 | 27.03,49.78 27.03,50.15 26.93,50.25
+5V  (via drill 0.6)
  Top 0.406: 85.3,25.48 FB6.1
  Top 0.6: v66.13,18.16 69.13,18.16 73.43,22.46 84.58,22.46 85.3,23.18 85.3,25.48 85.3,27.58 85.6,27.88 C65.+ | FB4.1 7.93,23.51 7.6,23.18 v5.9,23.18 D1.1 | D1.2 3.3,25.08 3.35,25.03 D1.1 | D1.1 3.1,23.18
  Bottom 0.6: v66.13,18.16 64.03,16.06 58.03,16.06 57.53,15.56 49.63,15.56 48.93,16.26 29.63,16.26 24.33,21.56 24.33,24.36 23.73,24.96 21.73,24.96 20.23,23.46 20.23,22.46 15.23,17.46 11.62,17.46 v5.9,23.18 5.8,23.18 5.58,23.4 F1.2
A0  (via drill 0.38 pad 0.74)
  Top 0.178: U1.133 46.23,50.76 48.13,48.86 v49.03,48.86
  Bottom 0.178: 48.93,41.06 U2.15 48.93,44.86 47.73,46.06 39.83,46.06 38.13,47.76 38.13,48.66 38.43,48.96 v49.03,48.86
A2  (via drill 0.38 pad 0.74)
  Top 0.178: U1.135 45.23,51.16 51.73,44.66 v55.33,44.66
  Bottom 0.178: 55.33,41.06 U2.23 v55.33,44.66
A3  (via drill 0.38 pad 0.74)
  Top 0.178: U1.136 44.73,51.14 52.01,43.86 v56.13,43.86
  Bottom 0.178: 56.13,41.06 U2.24 v56.13,43.86
A4  (via drill 0.38 pad 0.74)
  Top 0.178: U1.137 44.23,51.12 52.29,43.06 v56.93,43.06
  Bottom 0.178: 56.93,41.06 U2.25 v56.93,43.06
A5  (via drill 0.38 pad 0.74)
  Top 0.178: U1.138 43.73,51.1 52.57,42.26 v57.73,42.26
  Bottom 0.178: 57.73,41.06 U2.26 v57.73,42.26
A6  (via drill 0.38 pad 0.74)
  Top 0.178: U1.139 43.23,50.86 57.33,36.76 57.33,32.26 57.73,31.86 57.73,31.26 56.03,29.56 v56.03,29.06
  Bottom 0.178: U2.29 57.73,29.76 57.03,29.06 v56.03,29.06
A7  (via drill 0.38 pad 0.74)
  Top 0.178: U1.140 42.73,50.84 56.93,36.64 v56.93,31.46
  Bottom 0.178: U2.30 v56.93,31.46
A8  (via drill 0.38 pad 0.74)
  Top 0.178: U1.141 42.23,50.82 56.13,36.9 v56.13,32.06
  Bottom 0.178: U2.31 v56.13,32.06
A9  (via drill 0.38 pad 0.74)
  Top 0.178: U1.142 41.73,50.8 55.33,37.18 v55.33,31.46
  Bottom 0.178: U2.32 v55.33,31.46
A10  (via drill 0.38 pad 0.74)
  Top 0.178: U1.143 41.23,50.76 54.53,37.46 v54.53,32.06
  Bottom 0.178: U2.33 v54.53,32.06
A11  (via drill 0.38 pad 0.74)
  Top 0.178: v53.73,31.46 53.73,37.74 46.91,44.56 45.63,44.56 40.23,49.96 U1.145
  Bottom 0.178: U2.34 v53.73,31.46
A13  (via drill 0.38 pad 0.74)
  Top 0.178: U1.149 38.23,50.86 38.93,50.16 39.23,50.16 43.03,46.36 43.03,45.96 44.83,44.16 46.79,44.16 52.93,38.02 v52.93,32.06
  Bottom 0.178: U2.35 v52.93,32.06
A14  (via drill 0.38 pad 0.74)
  Top 0.178: U1.150 37.73,50.56 38.23,50.06 38.43,50.06 44.63,43.76 46.67,43.76 52.13,38.3 v52.13,31.46
  Bottom 0.178: U2.36 v52.13,31.46
A16  (via drill 0.38 pad 0.74)
  Top 0.178: U1.154 35.73,50.76 36.93,49.56 38.33,49.56 39.83,48.06 v39.83,47.36
  Bottom 0.178: U2.20 52.93,43.46 49.53,46.86 42.23,46.86 41.73,47.36 v39.83,47.36
A17  (via drill 0.38 pad 0.74)
  Top 0.178: U1.155 35.23,50.66 36.73,49.16 38.03,49.16 38.83,48.36 v38.83,48.06
  Bottom 0.178: U2.21 53.73,43.86 50.33,47.26 42.43,47.26 41.63,48.06 v38.83,48.06
CAS  (via drill 0.38 pad 0.74)
  Top 0.178: U1.177 36.25,40.46 36.85,39.86 48.63,39.86 v49.33,39.16
  Bottom 0.178: v49.33,39.16 49.33,39.66 49.93,40.26 50.33,40.26 50.53,40.46 U2.17
COL  (via drill 0.38 pad 0.74)
  Top 0.178: v70.33,48.76 69.73,48.76 69.43,48.46 U1.100
  Bottom 0.178: v70.33,48.76 70.03,48.36 70.03,41.96 68.83,40.76 68.83,39.06 70.13,37.76 70.13,37.26 69.73,36.86 69.23,36.86 69.13,36.96 68.23,36.96 68.25,36.98 U3.21
CRS  (via drill 0.38 pad 0.74)
  Top 0.178: U1.53 60.53,24.96 58.33,26.66 58.33,27.76 58.73,28.16 58.73,29.16 60.73,31.16 60.73,35.26 61.13,35.66 61.13,36.16 60.53,36.76 60.03,36.76 59.63,37.16 59.53,37.16 59.23,37.46 59.23,38.16 59.53,38.46 60.53,38.46 60.83,38.16 v60.85,38.16
  Bottom 0.178: U3.22 68.26,37.46 63.23,37.46 62.53,38.16 v60.85,38.16
CS  (via drill 0.38 pad 0.74)
  Top 0.178: U1.167 39.83,45.46 40.63,46.26 v40.63,46.71
  Bottom 0.178: 52.13,41.06 U2.19 52.13,43.06 48.73,46.46 41.73,46.46 41.48,46.71 v40.63,46.71
D0  (via drill 0.38 pad 0.74)
  Top 0.178: U1.179 34.63,39.46 35.63,38.46 38.23,38.46 v38.53,38.76
  Bottom 0.178: v38.53,38.76 38.63,38.86 38.53,38.96 U2.2
D1  (via drill 0.38 pad 0.74)
  Top 0.178: U1.180 34.53,38.96 35.53,37.96 39.63,37.96 v39.93,38.26
  Bottom 0.178: v39.93,38.26 40.13,38.46 U2.4
D2  (via drill 0.38 pad 0.74)
  Top 0.178: U1.181 34.43,38.46 35.43,37.46 40.33,37.46 v40.93,38.06
  Bottom 0.178: v40.93,38.06 U2.5
D3  (via drill 0.38 pad 0.74)
  Top 0.178: U1.182 34.33,37.96 35.33,36.96 41.83,36.96 42.53,37.66 v42.53,38.76
  Bottom 0.178: v42.53,38.76 U2.7
D4  (via drill 0.38 pad 0.74)
  Top 0.178: U1.185 33.93,36.46 34.43,35.96 35.93,35.96 36.43,36.46 42.53,36.46 43.33,37.26 43.33,38.46 v43.43,38.56
  Bottom 0.178: v43.43,38.56 43.33,38.66 U2.8
D5  (via drill 0.38 pad 0.74)
  Top 0.178: v44.73,38.76 44.93,38.56 44.93,36.86 44.03,35.96 36.53,35.96 36.13,35.56 34.23,35.56 33.83,35.96 U1.186
  Bottom 0.178: v44.73,38.76 44.83,38.76 44.93,38.86 U2.10
D6  (via drill 0.38 pad 0.74)
  Top 0.178: U1.187 33.73,35.46 34.03,35.16 36.83,35.16 37.13,35.46 44.73,35.46 45.73,36.46 v45.73,38.76
  Bottom 0.178: v45.73,38.76 U2.11
D7  (via drill 0.38 pad 0.74)
  Top 0.178: U1.190 33.93,33.96 34.13,33.76 35.93,33.76 36.13,33.96 45.23,33.96 47.33,36.06 47.33,38.56 v47.13,38.66
  Bottom 0.178: v47.13,38.66 47.33,38.76 U2.13
D8  (via drill 0.38 pad 0.74)
  Top 0.178: U1.191 33.83,33.46 33.93,33.36 36.13,33.36 36.23,33.46 46.73,33.46 47.33,32.86 v47.33,31.46
  Bottom 0.178: v47.33,31.46 U2.42
D9  (via drill 0.38 pad 0.74)
  Top 0.178: U1.192 45.23,32.96 45.73,32.46 v45.93,32.46
  Bottom 0.178: v45.93,32.46 45.73,32.26 U2.44
D10  (via drill 0.38 pad 0.74)
  Top 0.178: U1.193 41.23,32.46 41.33,32.56 43.23,32.56 43.33,32.46 44.53,32.46 v44.93,32.06
  Bottom 0.178: v44.93,32.06 44.83,32.06 44.93,31.96 U2.45
D11  (via drill 0.38 pad 0.74)
  Top 0.178: U1.194 41.43,31.96 41.63,32.16 43.03,32.16 v43.43,31.76
  Bottom 0.178: v43.43,31.76 43.33,31.66 U2.47
D12  (via drill 0.38 pad 0.74)
  Top 0.178: U1.195 v42.53,31.46
  Bottom 0.178: v42.53,31.46 U2.48
D13  (via drill 0.38 pad 0.74)
  Top 0.178: U1.196 34.33,30.96 35.83,29.46 40.83,29.46 v40.93,29.36
  Bottom 0.178: v40.93,29.36 U2.50
D14  (via drill 0.38 pad 0.74)
  Top 0.178: U1.197 34.23,30.46 35.83,28.86 39.93,28.86 v40.13,28.66
  Bottom 0.178: v40.13,28.66 U2.51
D15  (via drill 0.38 pad 0.74)
  Top 0.178: U1.198 34.13,29.96 35.83,28.26 38.23,28.26 v38.33,28.16
  Bottom 0.178: v38.33,28.16 38.53,28.36 U2.53
DM
  Top 0.178: U1.127 49.23,55.06 48.73,55.56 44.93,55.56 40.93,59.56 40.93,60.96 J79.1
DP
  Top 0.178: U1.128 48.73,53.86 48.83,53.96 48.83,54.86 48.53,55.16 44.73,55.16 39.63,60.26 39.63,62.16 38.33,63.46 38.43,63.46 38.39,63.5 J78.1
DQM1  (via drill 0.38 pad 0.74)
  Top 0.178: U1.172 34.63,42.96 v34.73,42.86
  Bottom 0.178: v34.73,42.86 34.73,39.86 40.23,34.36 42.43,34.36 | U2.39 49.73,33.56 48.93,34.36 42.43,34.36 | 42.43,34.36 42.33,34.36
FLS-RST  (via drill 0.38 pad 0.74)
  Top 0.178: U5.3 58.85,9.88 58.33,9.36 v58.33,8.76
  Bottom 0.178: 58.3,7.48 58.3,8.73 | R27.2 57.08,7.86 57.1,7.88 57.9,7.88 58.2,7.58 58.23,7.61 R28.1
  Bottom 0.18: R28.1 58.3,7.48 | 58.3,8.73 v58.33,8.76
GND  (via drill 0.38, 0.38 pad 0.74, 0.6, 0.6 pad 0.9)
  Top 0.178: U1.153 36.23,51.06 36.73,50.56 v36.93,50.56 | v39.23,50.86 U1.147 | U1.130 47.73,51.26 48.43,50.56 v48.83,50.56 48.93,50.56 | v54.03,50.66 54.23,50.86 U1.117 | v56.63,50.56 56.73,50.66 U1.112 | v47.33,50.66 46.73,51.26 U1.132 | 32.53,34.46 U1.189 v34.53,34.46 | v34.63,36.66 34.33,36.96 U1.184 | v34.43,28.66 34.13,28.96 U1.200 | 47.73,22.76 U1.27 47.73,24.92 v47.83,25.02 | v44.43,24.96 44.23,24.76 U1.20 | v55.63,24.86 55.63,24.66 54.73,23.76 U1.41 | v53.53,24.46 53.73,24.26 U1.39 | v49.63,24.66 49.23,24.16 U1.30 | 38.23,22.76 U1.8 38.23,24.06 38.73,24.56 v38.83,24.56 | v34.43,46.46 U1.165 | v51.53,24.36 51.23,24.06 U1.34 | v59.13,26.96 60.43,26.96 | U1.63 60.93,29.96 60.83,30.06 v60.83,30.36 | v75.58,37.01 75.63,37.06 75.33,37.06 74.83,37.56 74.83,37.86 74.53,38.16 72.83,38.16 | 72.85,32.76 v71.93,32.76 70.33,32.76 v70.13,32.96 | 70.23,35.86 70.23,35.96 70.13,36.06 | 69.23,35.86 69.21,35.64 C33.2 | 72.83,36.46 72.85,36.46 74.43,36.46 74.83,36.06 74.83,35.56 v75.13,35.26 | v79.93,39.26 80.15,39.04 R1.1 80.16,38.58 80.2,38.58 80.2,37.63 C60.2 | v60.63,45.96 61.13,45.46 U1.94 | 60.43,26.96 U1.57 | 60.43,26.96 v60.43,27.46 | C51.2 51.39,18.32 51.13,18.06 51.13,16.46 v51.08,16.41 51.43,16.06 51.43,14.46 C52.2 | 51.63,8.56 51.63,8.16 v51.13,7.66 | U5.7 51.68,8.61 51.73,8.56 | 56.43,9.26 v57.23,9.26 | v64.03,49.76 63.83,49.96 | U1.76 61.43,36.46 60.09,37.8 v59.99,37.8 | 69.43,35.86 v69.43,37.56 | v88.13,17.36 88.17,17.32 | 87.12,21.36 87.13,21.36 | 49.13,16.46 49.23,16.36 49.13,16.36 47.53,14.76 47.53,14.56 | 49.13,16.46 48.98,16.61 | C53.2 48.98,16.91 49.23,16.66 X1.2 49.13,16.46 | 47.53,14.36 X1.4 47.53,14.56
  Top 0.178: 49.13,16.46 49.18,16.41 | C52.2 51.33,14.46 | 48.5,13.26 48.03,13.26 47.53,13.76 47.53,14.56 | v11.63,28.26 | U7.6 11.23,27.86 v11.63,28.26 | R3.1 13.93,16.61 13.93,20.66 | 5.43,9.96 5.35,9.96 R8.2 | 85.34,35.95 85.24,35.95 85.23,35.96 C38.2 84.7,35.96 | v88.13,17.36 88.18,17.36 88.2,17.38 88.1,17.38 | 88.1,17.38 84.8,17.38 84.64,17.54 C64.2 75.36,17.54 73.6,15.78 73.6,13.38 RESET.1 | 87.12,21.68 v86.1,21.68 | C50.2 48.5,12.35 48.5,13.26 | 48.53,10.11 48.5,10.08 | J87.1 48.53,10.11 | 88.1,17.38 v88.12,17.36 v88.13,17.36 | C63.2 88.17,17.31 88.1,17.38 | 5.63,29.25 v5.63,28.96 5.48,28.81 R6.2 | 75.8,41.38 75.4,41.38 v75,40.98 | v21.83,53.66 v21.82,53.66 21.8,53.68 23.3,55.18 29.46,55.18 SD1.6 | 22,47.48 v22.02,47.46 v22.03,47.46 29.28,47.46 SD1.3 30.42,47.66 v30.8,47.28 | J90.1 91.74,7.62 92.53,8.41 R7.1 | JP1.5 93.4,16.38 93.4,16.88 v93.2,17.08 | 48.5,13.26 50.88,13.26 51.5,13.88 51.5,14.28 51.4,14.38 C52.2 | C45.2 49.45,11.03 48.53,10.11
  Top 0.406: C65.- 87.78,34.58 JP2.4
  Top 0.6: v48.13,33.56 49.73,35.16 v49.73,36.86 | 72.83,39.06 72.91,39.06 C36.2 | 72.83,39.16 72.83,39.14 | 72.83,39.14 C36.2 | 72.83,39.14 72.83,38.16 72.83,37.84 C34.2 72.85,37.34 | C37.2 72.85,32.76 72.85,33.74 72.83,33.76 C30.2 C29.2 | C29.2 72.83,35.56 | C29.2 72.85,36.46 72.85,37.34 | 72.85,37.34 72.83,37.36 | C33.2 69.14,35.86 69.23,35.86 69.43,35.86 70.23,35.86 71.35,35.86 C32.2 71.45,35.76 72.83,35.76 72.83,35.55 C29.2 | v64.03,49.76 65.53,49.76 65.83,50.06 v72.83,50.06 | C39.2 84.01,38.44 84.03,38.46 | C39.2 84.01,39.74 84.03,39.76 83.13,40.66 76.62,40.66 76.62,40.96 76.2,41.38 75.8,41.38 75.3,41.88 73.8,41.88 73.4,42.28 71.93,42.28 | 72.83,39.16 72.85,39.14 C36.2 | v71.93,46.16 71.93,42.28 | 71.93,42.28 71.93,40.06 72.83,39.16 | 84.63,35.96 84.7,35.96 | C39.2 84.63,37.88 84.63,35.96 | v32.73,52.16 32.73,57.96 v32.13,58.56 | v30.23,24.86 30.23,23.76 v27.53,21.06 | v56.43,16.56 56.43,9.26 56.43,8.56 51.73,8.56 51.63,8.56 48.53,8.56 | v28.13,32.96 v23.63,32.96 | J81.1 6.62,7.62 5.35,8.89 5.35,9.96 5.35,15.23 JP5.2 | 48.53,8.56 J87.1 | 48.53,8.56 J88.1 | v10.03,21.86 v10.02,21.86 10,21.88 5,16.88 JP5.2 | D1.3 1.15,19.43 JP5.2 | 87.29,18.88 87.12,19.05 87.12,21.36 87.12,21.68 87.1,21.68 v87.1,22.58 | 87.29,18.88 91.7,18.88 v91.7,19.78 | v88.13,17.36 88.1,17.36 88.1,17.38 88.1,18.88 87.29,18.88 | 84.63,35.96 86.28,35.96 v86.3,35.98 | C68.- 82.89,25.67 v83.9,26.68
  Bottom 0.15: 51.8,11.31 C55.2 | 48.5,10.18 48.51,10.18 J87.1 | 51.1,7.68 51.11,7.68 v51.13,7.66
  Bottom 0.178: v48.13,33.56 U2.41 48.13,29.16 48.93,28.36 48.93,27.86 | 44.13,33.56 U2.46 | 39.33,32.76 U2.52 | 37.73,32.76 U2.54 | 46.53,37.16 46.43,37.26 46.43,40.06 46.53,40.16 U2.12 | 41.73,37.26 U2.6 | 37.13,49.76 37.13,50.16 v36.93,50.56 36.73,50.76 C12.2 | 39.63,49.76 39.63,49.86 39.73,49.86 C17.2 | 48.83,49.76 v48.83,50.56 v48.82,50.56 48.57,50.81 C19.2 | 50.83,49.76 50.83,49.66 | C5.2 57.33,46.16 | C5.2 57.33,46.16 | 56.83,49.66 56.73,49.76 56.63,49.86 v56.63,50.56 | 56.83,49.66 57.33,49.16 C5.2 | 54.03,49.76 v54.03,50.66 | 46.73,49.66 47.33,49.76 v47.33,50.66 | 35.33,36.66 v34.63,36.66 | 35.33,34.46 v34.53,34.46 | 47.23,49.66 48.43,49.76 47.93,50.26 47.93,51.16 47.23,51.86 C18.2 | 54.63,49.76 54.63,49.66 54.68,49.71 | 54.68,49.71 54.73,49.76 | C20.2 57.23,50.06 56.83,49.66 | 54.68,49.71 54.73,49.66 C13.2 | C10.2 50.03,27.86 49.23,27.86 | 43.73,26.18 C15.2 | 44.23,26.18 44.23,25.16 v44.43,24.96 | 47.13,26.68 47.13,26.66 47.23,26.56 47.23,25.06 | 47.23,25.06 47.23,25.02 v47.83,25.02 | v53.53,24.46 53.03,24.96 53.03,27.86 | v51.53,24.36 51.23,24.66 51.23,27.86 51.73,27.86 C27.2 | 49.23,27.86 49.23,27.96 | 49.23,27.86 49.23,25.36 v49.63,24.66 | 38.63,25.56 38.63,25.46 38.63,24.76 v38.83,24.56 | 37.73,24.96 37.73,24.86 37.73,23.36 37.74,23.35 C26.2 | 34.43,45.16 v34.43,46.46 | 35.33,35.16 33.33,35.16 33.28,35.11 C11.2 | 35.33,37.36 35.33,37.46 C9.2 | 35.33,28.76 35.33,28.66 v34.43,28.66 | C8.2 33.38,29.56 35.33,29.56 | 33.23,46.99 C16.2 35.72,46.97 35.73,46.96 | C27.2 52.13,27.46 | C27.2 | 55.63,27.86 v55.63,24.86 | U2.28 59.73,30.36 v60.83,30.36 | 58.73,27.86 v59.13,26.96 | 59.73,29.46 C14.2 | 59.53,48.56 59.53,48.86 | v75.58,37.01 76.16,37.49 U3.39 77.56,37.49 79.33,39.26 v79.93,39.26
  Bottom 0.178: 76.63,35.46 76.03,35.46 75.83,35.26 v75.13,35.26 | 76.63,35.46 U3.43 | U3.44 76.67,35.42 76.63,35.46 | U3.12 69.73,31.56 69.73,32.56 v70.13,32.96 | U3.8 71.73,31.53 71.73,32.56 v71.93,32.76 | U3.23 68.33,37.96 68.83,37.96 v69.43,37.56 | C31.2 63.64,38.25 63.03,38.86 59.74,38.85 59.48,39.11 | 59.38,39.21 59.48,39.11 | 58.83,38.66 59.69,37.8 v59.99,37.8 60.35,37.44 C22.2 | 59.48,39.11 59.53,39.16 | 72.82,49.75 v72.83,50.06 v72.83,50.05 72.9,49.98 73.6,49.98 74.6,48.98 74.6,47.18 74.2,46.78 74.2,45.18 72.87,43.85 C35.2 | 74.73,39.94 U3.35 74.77,40.75 v75,40.98 75.27,40.71 U3.36 75.33,39.96 | 59.53,45.86 59.53,45.96 v60.63,45.96 | 51.13,17.26 51.13,16.46 v51.08,16.41 | C56.2 57.13,10.26 57.23,10.16 | v57.23,9.26 57.23,10.16 | R20.1 56.09,46.22 56.13,46.26 R21.1 57.27,46.22 57.33,46.16 | 39.23,49.66 39.23,49.76 v39.23,50.86 | 88.43,17.36 88.71,17.08 | 88.43,17.36 88.45,17.38 | v88.13,17.36 88.43,17.36 | v88.13,17.36 88.11,17.36 89.83,15.91 90.15,15.59 90.15,14.98 U6.17 90.2,13.68 89.96,13.44 C62.2 | v88.13,17.36 88.11,17.34 88.11,16.95 86.76,15.6 86.76,14.95 86.72,14.95 U6.24 | 28.93,58.46 28.93,58.56 28.93,62.46 | 28.93,62.46 31.13,64.66 55.52,64.66 56.1,64.08 56.1,63.48 56.12,63.5 JP4.4 | 56.23,63.46 56.19,63.46 56.19,63.47 56.2,63.48 | 68.83,63.46 68.83,63.48 | X3.4 80.63,33.66 81.73,34.76 82.13,34.76 82.63,35.26 | 82.63,35.26 X3.2 | C24.2 54.23,27.56 | C24.2 54.24,27.85 | C24.2 54.33,27.46 | 61.13,44.96 C21.2 59.53,44.96 | 47.23,25.06 C25.2 | C23.2 61.33,26.96 60.83,27.46 v60.43,27.46 | 46.13,26.18 46.13,26.06 | U6.4 88.2,18.38 88.1,18.38 88.1,17.36 v88.13,17.36 | 88.5,17.28 88.7,17.28 U6.20
  Bottom 0.178: C41.2 85.1,21.68 v86.1,21.68 | 88.5,17.28 U6.33 | 88.43,17.36 88.43,17.35 88.5,17.28 | v88.13,17.36 88.15,17.36 88.15,16.03 U6.26 | U4.2 97.47,31.18 96.7,31.18 96.6,31.28 96.6,32.08 94.2,34.48 90.9,34.48 | 88.4,35.98 88.4,35.78 | 86.3,35.38 86.4,35.38 86.28,35.26 82.63,35.26 | 51.8,11.31 50.67,10.18 48.51,10.18 | 57.23,10.16 58.08,10.16 59.4,11.48 | 28.93,62.46 28,62.46 C46.1 | 89.65,40.23 89.45,40.23 C40.1 | J86.1 78.99,63.48 76.49,63.48 JP4.20 76.45,63.48 73.91,63.48 | 73.91,63.48 73.9,63.48 | 73.91,63.48 JP4.18 | 73.91,63.48 71.4,63.48 JP4.16 71.37,63.48 68.87,63.48 JP4.14 68.82,63.5 68.8,63.48 | 68.83,63.46 68.81,63.48 68.8,63.48 | 68.8,63.48 66.3,63.48 JP4.12 66.29,63.48 63.79,63.48 | 63.79,63.48 JP4.10 63.72,63.5 63.7,63.48 | 61.21,63.48 61.2,63.48 | 61.21,63.48 JP4.8 | 61.21,63.48 63.7,63.48 | 63.7,63.48 63.79,63.48 | 61.21,63.48 58.7,63.48 JP4.6 58.67,63.48 56.2,63.48 | JP4.4 56.17,63.48 56.2,63.48 | 68.83,63.46 68.82,63.46 68.8,63.48 | 63.83,63.46 63.72,63.46 63.7,63.48 | 56.2,63.48 56.18,63.5 JP4.4 | 86.6,23.08 86.7,23.18 | JP6.2 47.61,3.57 44.7,6.48 44.7,8.28 45.3,8.88 47.3,8.88 48.53,7.65 J88.1 | 25.7,58.56 25.7,58.48 25.75,58.43 25.8,58.48 | v21.83,53.66 v21.82,53.66 21,54.48 C67.- | v22.03,47.46 v22.02,47.46 21.88,47.6 C66.- | 86.3,27.58 C59.2 | 94.2,17.08 | 94.2,17.08 v93.2,17.08 | v51.13,7.66 51.13,7.41 51.1,7.38 51.76,6.72 C54.2 | C49.2 31.2,47.68 v30.8,47.28
  Bottom 0.18: 59.4,11.48 C57.2
  Bottom 0.6: v30.23,24.86 37.73,24.86 37.93,24.86 38.53,25.46 38.63,25.46 41.03,25.46 41.72,26.15 C1.2 41.74,26.26 43.63,26.26 43.73,26.18 44.23,26.18 46.13,26.18 46.15,26.18 46.57,26.6 C2.2 47.13,26.68 47.13,26.76 47.73,27.36 48.43,27.36 48.47,27.32 | v48.13,33.56 44.13,33.56 43.93,33.56 43.13,32.76 39.33,32.76 37.73,32.76 35.33,32.76 | 35.73,45.16 34.43,45.16 | 35.73,45.16 37.73,45.16 C3.2 37.8,45.16 39.34,45.16 C4.2 39.5,45.16 44.23,45.16 44.23,45.14 | 44.23,45.14 C6.2 | C7.2 47.03,45.16 44.25,45.16 44.23,45.14 | 41.73,37.26 46.43,37.26 49.12,37.26 49.5,36.88 v49.73,36.86 56.53,36.86 | 35.83,49.76 37.13,49.76 39.23,49.76 39.63,49.76 47.33,49.76 48.43,49.76 48.83,49.76 50.83,49.76 54.03,49.76 54.63,49.76 56.63,49.76 | 35.83,49.76 35.73,49.76 35.73,46.96 35.73,45.16 | 56.63,49.76 56.73,49.76 | 35.33,32.96 35.33,34.46 35.33,35.16 35.33,36.66 35.33,37.36 | 54.23,27.86 54.24,27.85 | 35.33,32.76 35.33,32.96 | 35.33,32.76 35.33,29.56 35.33,28.76 | 48.47,27.32 C28.2 | 48.47,27.32 48.47,27.4 48.93,27.86 49.23,27.86 51.23,27.86 53.03,27.86 54.23,27.86 | 59.53,48.56 59.53,45.86 59.53,44.96 59.53,39.36 59.38,39.21 58.83,38.66 58.38,38.66 57.88,38.16 57.83,38.16 56.53,36.86 | 54.23,27.86 55.63,27.86 58.73,27.86 59.73,28.86 59.73,29.46 59.73,30.36 59.73,31.46 59.03,32.16 57.43,32.16 56.53,33.06 56.53,36.86 | 59.53,49.76 56.63,49.76 | 59.53,49.76 v64.03,49.76 | 59.53,48.86 59.53,49.76 | v72.83,50.06 72.83,47.46 71.93,46.56 v71.93,46.16 | 35.83,49.76 35.83,49.66 33.33,52.16 v32.73,52.16 | v32.13,58.56 28.93,58.56 25.7,58.56 20.08,58.56 18.6,57.08 18.6,55.58 | v27.53,21.06 27.53,20.26 30.53,17.26 51.13,17.26 55.73,17.26 v56.43,16.56
  Bottom 0.6: 35.33,32.96 v28.13,32.96 | v23.63,32.96 v18.33,32.96 17.93,32.96 | JP5.2 5.1,15.48 | 86.3,26.68 86.3,27.58 86.3,35.38 v86.3,35.98 87.7,35.98 | 86.3,26.68 86.3,23.38 86.6,23.08 v87.1,22.58 | 87.7,35.98 88.4,35.98 | 90.9,34.48 JP2.4 89.6,34.58 88.4,35.78 | 87.7,35.98 87.7,38.28 89.65,40.23 | v91.7,19.78 92.6,19.78 94.2,18.18 94.2,17.08 94.2,10.18 91.7,7.68 91.71,7.67 J90.1 | 18.6,55.58 18.6,50.18 | 18.6,50.18 18.6,43.98 | 18.6,43.98 18.6,35.58 17.2,34.18 | 18.6,50.18 C66.- | C67.- 18.65,55.53 18.6,55.58 | 86.3,26.68 v83.9,26.68 | C58.1 13.9,44.1 R22.2 18.5,44.08 18.6,43.98
  other vias: 18.03,33.86 12.23,20.96 5.53,27.96 14.93,21.76 16.73,20.96 12.83,28.26 12.33,23.66 16.33,34.96 10.73,21.26 14.4,27.78
  pour Top: 4.53,26.66 4.53,30.45 4.56,30.48 7.89,30.48 7.89,33.81 9.54,35.46 17.23,35.46 17.23,35.46 19.23,33.46 19.23,33.46 19.23,29.46 18.23,28.46 18.23,21.46 17.23,20.46 10.73,20.46
  pour Bottom (no thermals): 10.73,20.46 3.73,27.46 3.73,29.65 9.54,35.46 16.73,35.46 17.23,35.46 19.23,33.46 19.23,33.46 19.23,29.46 18.23,28.46 18.23,21.46 17.23,20.46
HDMA  (via drill 0.38 pad 0.74)
  Top 0.178: U1.125 50.23,55.26 47.41,58.08 46.45,58.08 v46.43,58.06 45.31,59.18 44.5,59.18 43.4,60.28 43.4,60.88 43.45,60.93 J82.1
  Bottom 0.178: 97.5,30.48 U4.3 98.4,30.48 99.15,31.23 99.15,37.63 96.5,40.28 95.5,40.28 94.65,41.13 94.65,56.13 96,57.48 97.35,57.48 100.5,60.63 100.5,64.03 99.85,64.68 80.8,64.68 80.3,64.18 80.3,62.78 79.8,62.28 75.65,62.28 75.2,61.83 75.2,59.73 73.63,58.16 59.33,58.16 58.93,58.56 46.93,58.56 46.5,58.13 46.5,58.08 46.45,58.08 v46.43,58.06
HDPA  (via drill 0.38 pad 0.74)
  Top 0.178: U1.126 49.73,55.16 47.71,57.18 45.9,57.18 45,58.08 45,58.29 v44.93,58.36 43.82,58.36 42.2,59.98 42.2,62.18 40.9,63.48 J83.1 | v95.85,39.28 95.85,39.93 94.65,41.13 94.65,56.13 96,57.48 97.35,57.48 98.1,58.23 98.1,64.08 97.5,64.68 80.8,64.68 80.3,64.18 80.3,62.78 79.8,62.28 75.65,62.28 75.2,61.83 75.2,60.33 74.03,59.16 73.58,59.16 73.3,58.88 v73.32,58.86 v73.33,58.86
  Bottom 0.178: 97.6,31.78 U4.1 97.58,31.83 97.6,31.83 97.6,37.53 v95.85,39.28 | v44.93,58.36 44.98,58.36 45.58,58.96 70.33,58.96 70.73,58.56 72.98,58.56 73.23,58.81 v73.33,58.86
J1
  Bottom 0.178: U4.4 92.4,30.48 92,30.08 JP2.2 90.6,29.98
LED0  (via drill 0.38 pad 0.74)
  Top 0.178: v73.93,48.36 73.93,50.81 75,51.88 75,53.28 76.5,54.78 JP3.P13
  Bottom 0.178: U3.26 70.19,40.56 71.73,42.1 71.73,44.56 72.73,45.46 72.73,46.31 73.9,47.48 73.9,48.28 73.93,48.31 v73.93,48.36
LED1  (via drill 0.38 pad 0.74)
  Top 0.178: JP3.P16 74.18,42.6 73.2,43.58 73.2,45.08 73.48,45.36 | 73.48,45.36 73.5,45.38 | v73.43,45.36 73.48,45.36
  Bottom 0.178: U3.27 70.67,39.9 | 70.67,39.9 70.63,39.86 | 70.67,39.9 70.67,40.4 72.13,41.86 72.13,44.06 v73.43,45.36
MDC  (via drill 0.38 pad 0.74)
  Top 0.178: U1.59 63.43,27.96 65.03,26.36 69.03,26.36 69.83,27.16 74.93,27.16 v75.23,27.46
  Bottom 0.178: v75.23,27.46 74.77,27.92 U3.2
MDIO  (via drill 0.38 pad 0.74)
  Top 0.178: U1.60 63.53,28.46 65.23,26.76 68.83,26.76 69.63,27.56 73.03,27.56 73.93,28.46 v75.43,28.46
  Bottom 0.178: U3.1 75.27,28.52 v75.43,28.46
N$1
  Bottom 0.178: JP3.P14 76.42,52.28 76.4,52.28 76.4,50.68 R24.2
N$2  (via drill 0.38 pad 0.74)
  Top 0.178: JP3.P15 77.4,46.08 77.4,46.78 78.1,47.48 v78.1,48.88
  Bottom 0.178: R19.2 77.04,48.88 v78.1,48.88
N$3
  Top 0.178: 3.3V.C 16.19,16.89 16.2,16.88 15.88,16.56 R3.2
N$4  (via drill 0.38 pad 0.74)
  other vias: 82.1,39.68
N$5  (via drill 0.38 pad 0.74)
  Top 0.178: 74.33,33.66 74.33,33.96 C30.1 74.15,33.84 | v75.08,33.16 74.93,33.16 74.63,33.46 74.53,33.46 74.15,33.84 | 74.15,33.84 74.13,33.86
  Bottom 0.178: v75.08,33.16 75.23,33.16 76,33.93 U3.46 76.7,33.96 78.63,33.96 79.13,33.46 79.13,32.76 79.53,32.36 81.53,32.36 82.03,32.86 82.03,33.66 X3.3
N$6  (via drill 0.38 pad 0.74)
  Top 0.178: C29.1 74.16,35.13 75.03,34.26 v75.08,34.26
  Bottom 0.178: 75.03,34.26 v75.08,34.26 75.63,34.26 75.81,34.44 U3.45 76.69,34.46 78.63,34.46 79.43,35.26 X3.1
N$7  (via drill 0.38 pad 0.74)
  Top 0.178: v77.73,38.56 77.64,38.57 R1.2 79.06,38.58 79.1,38.58 79.1,37.63 C60.1
  Bottom 0.178: U3.37 77.57,38.5 v77.73,38.56
N$8